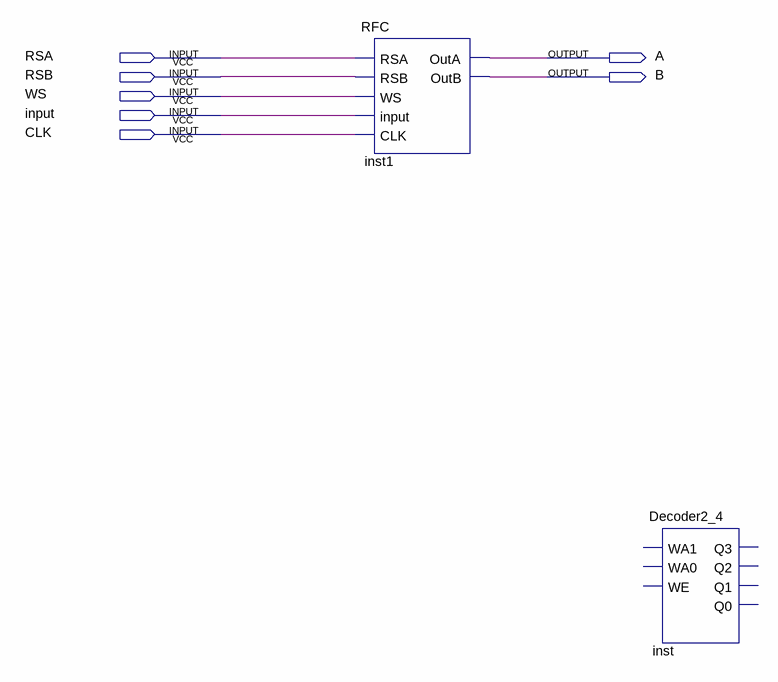
[diagram p0: schematic sheet]
// Quartus schematic test.bdf as structural Verilog: 2 symbols, 7 pins
module test (
  input  RSA,
  input  RSB,
  input  WS,
  input  \input ,
  input  CLK,
  output A,
  output B
);

  RFC inst1 (.RSA(RSA), .RSB(RSB), .WS(WS), .\input (\input ), .CLK(CLK), .OutA(A), .OutB(B));
  Decoder2_4 inst ();  // open: WA1, WA0, WE, Q3, Q2, Q1, Q0
endmodule
